# Altium schematic sheet Full_Bridge_Inverter.SchDoc
size A4; SheetNumber: 1; SheetTotal: 3
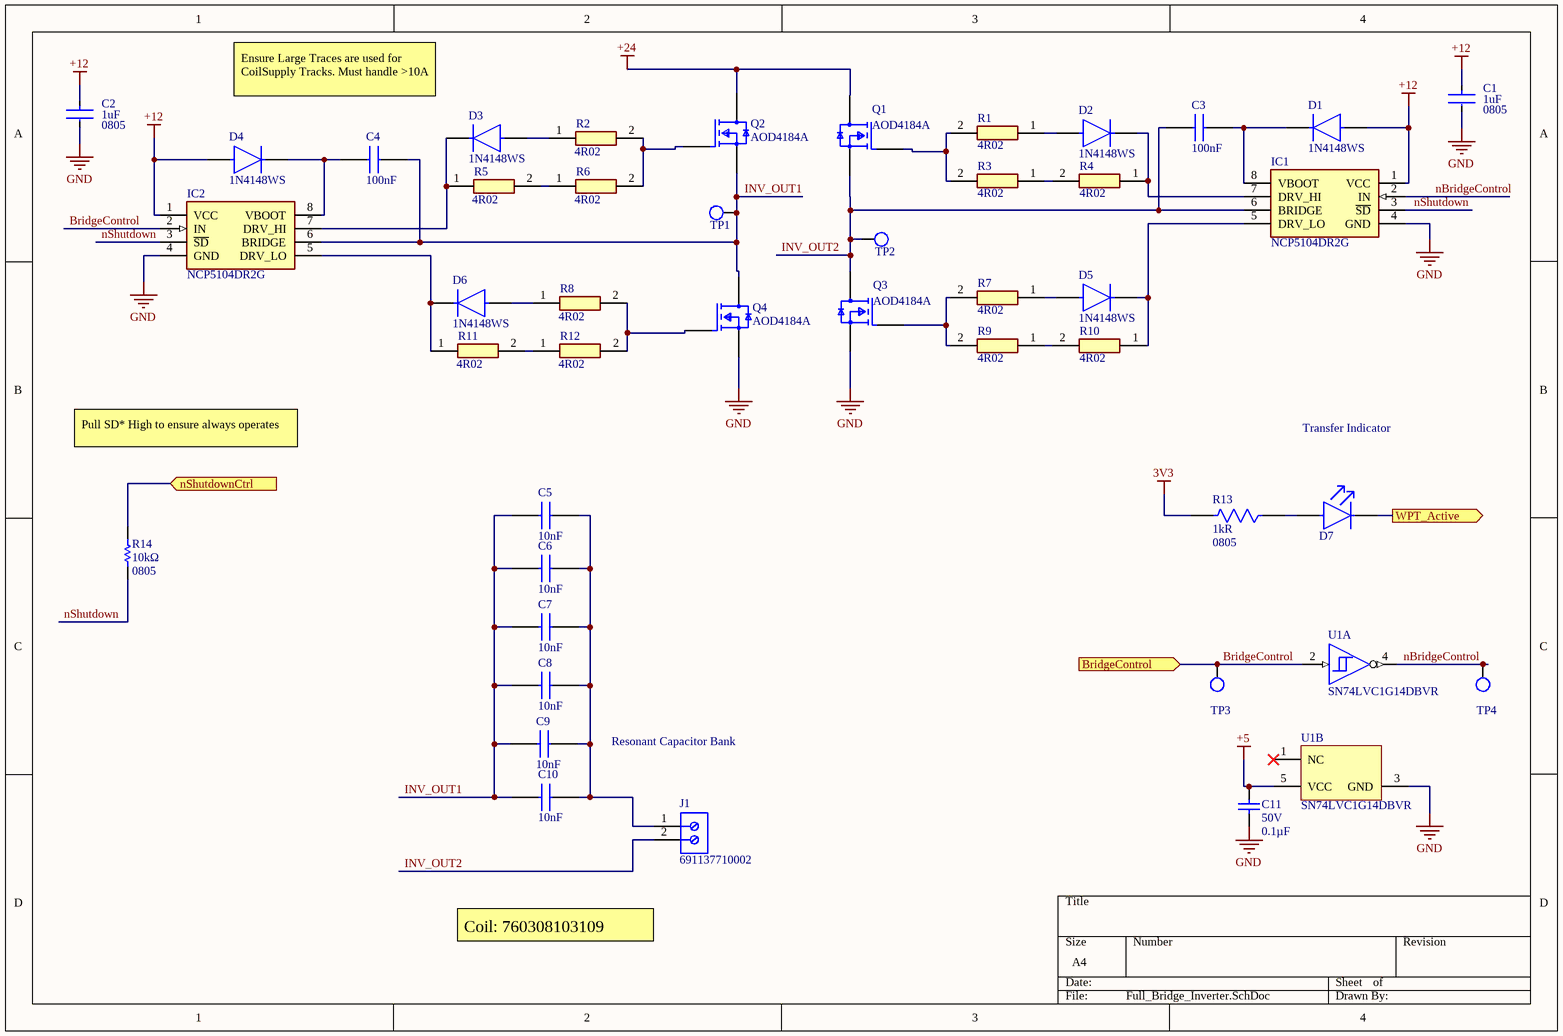
[diagram p0: Full_Bridge_Inverter.SchDoc]

## Parts
C1  Capacitance: 1uF  Case Code (Imperial): 0805  [FP-885012207078-MFG]  (hidden comment: 885012207078)
C2  Capacitance: 1uF  Case Code (Imperial): 0805  [FP-885012207078-MFG]  (hidden comment: 885012207078)
C3  Capacitance: 100nF  [C0805]  (hidden comment: C0805C104K1RACAUTO7210)
C4  Capacitance: 100nF  [C0805]  (hidden comment: C0805C104K1RACAUTO7210)
C5  Capacitance: 10nF  [CAPC3216X110N]  (hidden comment: C1206C103JAGECAUTO)
C6  Capacitance: 10nF  [CAPC3216X110N]  (hidden comment: C1206C103JAGECAUTO)
C7  Capacitance: 10nF  [CAPC3216X110N]  (hidden comment: C1206C103JAGECAUTO)
C8  Capacitance: 10nF  [CAPC3216X110N]  (hidden comment: C1206C103JAGECAUTO)
C9  Capacitance: 10nF  [CAPC3216X110N]  (hidden comment: C1206C103JAGECAUTO)
C10  Capacitance: 10nF  [CAPC3216X110N]  (hidden comment: C1206C103JAGECAUTO)
C11  Voltage - Rated: 50V  Capacitance: 0.1µF  [CAP0805]  (hidden comment: C0805C104K5RACTU)
D1  1N4148WS  [FP-477AB-IPC_C]
D2  1N4148WS  [FP-477AB-IPC_C]
D3  1N4148WS  [FP-477AB-IPC_C]
D4  1N4148WS  [FP-477AB-IPC_C]
D5  1N4148WS  [FP-477AB-IPC_C]
D6  1N4148WS  [FP-477AB-IPC_C]
D7  150060VS75000  [FP-150060VS75000-MFG]  (value not drawn)
IC1  NCP5104DR2G  [SOIC127P600X175-8N]
IC2  NCP5104DR2G  [SOIC127P600X175-8N]
J1  691137710002  [691137710002]
Q1  AOD4184A  [FP-TO252-MFG]
Q2  AOD4184A  [FP-TO252-MFG]
Q3  AOD4184A  [FP-TO252-MFG]
Q4  AOD4184A  [FP-TO252-MFG]
R1  Resistance: 4R02  [RESC3216X70N]  (hidden comment: RMCF1206FT4R02)
R2  Resistance: 4R02  [RESC3216X70N]  (hidden comment: RMCF1206FT4R02)
R3  Resistance: 4R02  [RESC3216X70N]  (hidden comment: RMCF1206FT4R02)
R4  Resistance: 4R02  [RESC3216X70N]  (hidden comment: RMCF1206FT4R02)
R5  Resistance: 4R02  [RESC3216X70N]  (hidden comment: RMCF1206FT4R02)
R6  Resistance: 4R02  [RESC3216X70N]  (hidden comment: RMCF1206FT4R02)
R7  Resistance: 4R02  [RESC3216X70N]  (hidden comment: RMCF1206FT4R02)
R8  Resistance: 4R02  [RESC3216X70N]  (hidden comment: RMCF1206FT4R02)
R9  Resistance: 4R02  [RESC3216X70N]  (hidden comment: RMCF1206FT4R02)
R10  Resistance: 4R02  [RESC3216X70N]  (hidden comment: RMCF1206FT4R02)
R11  Resistance: 4R02  [RESC3216X70N]  (hidden comment: RMCF1206FT4R02)
R12  Resistance: 4R02  [RESC3216X70N]  (hidden comment: RMCF1206FT4R02)
R13  Resistance: 1kR  Size Code: 0805  [FP-RNCP0805-MFG]  (hidden comment: RNCP0805FTD1K00)
R14  Resistance: 10kΩ  Package / Case: 0805  [RES0805]  (hidden comment: RC0805FR-0710KL)
TP1  Bridge 1  [TESTPOINT_LOOP]  (value not drawn)
TP2  Bridge 2  [TESTPOINT_LOOP]  (value not drawn)
TP3  Oscillator Out  [TESTPOINT_LOOP]  (value not drawn)
TP4  NOT Oscillator Out  [TESTPOINT_LOOP]  (value not drawn)
U1  SN74LVC1G14DBVR  [DBV0005A_L]  (parts A,B of 2)

## Ports
BridgeControl (in), nShutdownCtrl (in), WPT_Active (out)

## Nets
3V3: R13.2
+5: C11.2 U1.5(VCC)
+12: C1.1 C2.1 D1.2(A) D4.2(A) IC1.1(VCC) IC2.1(VCC)
+24: Q1.4(D) Q2.4(D)
GND: C1.2 C2.2 C11.1 IC1.4(GND) IC2.4(GND) Q3.3(S) Q4.3(S) U1.3(GND)
BridgeControl: IC2.2(IN) TP3.1 U1.2(A) ; port BridgeControl
INV_OUT1: C4.2 C5.1 C6.1 C7.1 C8.2 C9.2 C10.2 IC2.6(BRIDGE) Q2.3(S) Q4.4(D) TP1.1
INV_OUT2: C3.1 IC1.6(BRIDGE) J1.2 Q1.3(S) Q3.4(D) TP2.1
nBridgeControl: IC1.2(IN) TP4.1 U1.4(Y)
nShutdown: IC1.3(~{SD}) IC2.3(~{SD}) R14.1
nShutdownCtrl: R14.2 ; port nShutdownCtrl
WPT_Active: D7.1(C) ; port WPT_Active
NetC3_2: C3.2 D1.1(C) IC1.8(VBOOT)
NetC4_1: C4.1 D4.1(C) IC2.8(VBOOT)
NetC5_2: C5.2 C6.2 C7.2 C8.1 C9.1 C10.1 J1.1
NetD2_1: D2.1(C) IC1.7(DRV_HI) R4.1
NetD2_2: D2.2(A) R1.1
NetD3_1: D3.1(C) IC2.7(DRV_HI) R5.1
NetD3_2: D3.2(A) R2.1
NetD5_1: D5.1(C) IC1.5(DRV_LO) R10.1
NetD5_2: D5.2(A) R7.1
NetD6_1: D6.1(C) IC2.5(DRV_LO) R11.1
NetD6_2: D6.2(A) R8.1
NetD7_2: D7.2(A) R13.1
NetQ1_1: Q1.1(G) R1.2 R3.2
NetQ2_1: Q2.1(G) R2.2 R6.2
NetQ3_1: Q3.1(G) R7.2 R9.2
NetQ4_1: Q4.1(G) R8.2 R12.2
NetR3_1: R3.1 R4.2
NetR5_2: R5.2 R6.1
NetR9_1: R9.1 R10.2
NetR11_2: R11.2 R12.1

Not connected (* = marked no-connect by the designer): U1 1(NC)*

## Notes on the sheet
- Ensure Large Traces are used for CoilSupply Tracks. Must handle >10A
- Pull SD* High to ensure always operates
- Transfer Indicator
- Resonant Capacitor Bank
- Coil: 760308103109

## Library data of the parts
C1 C2 = CMP-207839-000010-1: CAP CER 1UF 25V X7R 0805; Tolerance: 10%; Series: WCAP-CSGP; Mount: Surface Mount; RoHS Compliant: Yes; Case Code (Metric): 2012; Width: 0.049inch; Thickness: 0.053inch; Dielectric: X7R; Max Operating Temperature: 125°C; Case/Package: 0805; Length: 0.079inch; Voltage Rating: 25V; Packaging: Cut Tape; Min Operating Temperature: -55°C; Voltage Rating (DC): 25V
C3 C4 = C0805C104K1RACAUTO7210: Capacitor; Manufacturer_Name: KEMET; Datasheet Link: https://content.kemet.com/datasheets/KEM_C1023_X7R_AUTO_SMD.pdf; Height: 1.1mm; Manufacturer_Part_Number: C0805C104K1RACAUTO7210; Mouser Part Number: 80-C0805C104K1RAUTLR; Mouser Price/Stock: https://www.mouser.co.uk/ProductDetail/KEMET/C0805C104K1RACAUTO7210?qs=NJR6qtu0rR34GE7CYHVK6Q%3D%3D; Arrow Part Number: C0805C104K1RACAUTO7210; Arrow Price/Stock: https://www.arrow.com/en/products/c0805c104k1racauto7210/kemet-corporation?region=europe
C5-C10 = C1206C103JAGECAUTO: Capacitor; Manufacturer_Name: KEMET; Datasheet Link: https://content.kemet.com/datasheets/KEM_C1091_C0G_ESD.pdf; Height: 1.1mm; Manufacturer_Part_Number: C1206C103JAGECAUTO; Mouser Part Number: 80-C1206C103JAGECAUT; Mouser Price/Stock: https://www.mouser.co.uk/ProductDetail/KEMET/C1206C103JAGECAUTO?qs=MLItCLRbWsxJM3Q8yxQv7A%3D%3D; Arrow Part Number: C1206C103JAGECAUTO; Arrow Price/Stock: https://www.arrow.com/en/products/c1206c103jagecauto/kemet-corporation?region=nac
C11 = C0805C104K5RACTU: CAP CER 0.1UF 50V X7R 0805; Tolerance: ±10%; Supplier 1: Digi-Key; Supplier Part Number 1: 399-1170-1-ND; Temperature Coefficient: X7R; Package / Case: 0805
D1-D6 = CMP-07163-000040-1: DIODE GEN PURP 75V 150MA SOD323F; Forward Voltage: 1V; Power Dissipation: 200mW; Element Configuration: Single; Max Forward Surge Current (Ifsm): 2A; Peak Reverse Current: 5uA; Recovery Time: 4ns; Package Quantity: 1; Number of Pins: 2; Height: 1mm; REACH SVHC: No SVHC; Max Reverse Voltage (DC): 75V; Forward Current: 150mA; Length: 1.8mm; Max Repetitive Reverse Voltage (Vrrm): 75V; Max Operating Temperature: 150°C; Average Rectified Current: 150mA; Contact Plating: Tin; Packaging: Tape and Reel; Radiation Hardening: No; Min Operating Temperature: -55°C; Width: 1.35mm; Weight: 0.0276g; Lead Free: Lead Free; Mount: Surface Mount; Reverse Voltage: 75V; Reverse Recovery Time: 4ns
D7 = CMP-1426-00006-5: LED GREEN CLEAR 0603 SMD; Viewing Angle: 140°; Reverse Voltage (DC): 5V; Forward Voltage: 2V; Power Rating: 72mW; Lens Size: 0.7mm; Test Current: 20mA; Lens Color: Colorless; Lens Style: Rectangular; Luminous Intensity: 40mcd; Wavelength: 570nm; Length: 1.6mm; Max Operating Temperature: 85°C; Lens Transparency: Clear; Width: 0.8mm; Mount: Surface Mount; Weight: 0.000882oz; Package Quantity: 4000; Packaging: Cut Tape; RoHS Compliant: Yes; Case/Package: 0603; Series: WL-SMCW; Case Code (Metric): 1608; Illumination Color: Green; Color: Green; Case Code (Imperial): 0603; Forward Current: 20mA; Min Operating Temperature: -40°C; Height: 0.8mm; Dominant Wavelength: 570nm; Number of Pins: 2
IC1 IC2 = NCP5104DR2G: Integrated Circuit; Manufacturer_Name: onsemi; Datasheet Link: http://www.onsemi.com/pub/Collateral/NCP5104-D.PDF; Height: 1.75mm; Manufacturer_Part_Number: NCP5104DR2G; Mouser Part Number: 863-NCP5104DR2G; Mouser Price/Stock: https://www.mouser.co.uk/ProductDetail/onsemi/NCP5104DR2G?qs=t2BMfLoP1KTbDonJSvc7wQ%3D%3D; Arrow Part Number: NCP5104DR2G; Arrow Price/Stock: https://www.arrow.com/en/products/ncp5104dr2g/on-semiconductor
J1 = CMP-1502-03324-1: Series 1377 - 5.00 mm Horizontal Entry with Pressure Clamp WR-TBL, 2 pin; Manufacturer: Wurth Elektronik; Pin Number: 2; Pitch: 5.00mm; Operating Temperature: -30to120degC; Package Reference: 691137710002; Publisher: WurthElektronik; Mounting Technology: THT; Manufacturer URL: http://www.we-online.de; Packaging: Box; Part Number: 691137710002; Datasheet URL: http://katalog.we-online.de/pbs/datasheet/691137710002.pdf
Q1-Q4 = CMP-83955-000007-1: MOSFET N-CH 40V 50A TO252; Power Dissipation: 50W; Rds On Max: 7mR; Input Capacitance: 1.8nF; Gate to Source Voltage (Vgs): 20V; Number of Elements: 1; Max Power Dissipation: 2.3W; Min Operating Temperature: -55°C; Drain to Source Voltage (Vdss): 40V; Max Operating Temperature: 175°C; Case/Package: DPAK; Mount: Surface Mount; Continuous Drain Current (ID): 50A; Packaging: Cut Tape; Number of Pins: 3; Radiation Hardening: No
R1-R12 = RMCF1206FT4R02: Resistor; Manufacturer_Name: Stackpole Electronics; Datasheet Link: https://cs.seielect.com/catalog/SEI-RMCF_RMCP.pdf; Height: 0.7mm; Manufacturer_Part_Number: RMCF1206FT4R02; Arrow Part Number: RMCF1206FT4R02; Arrow Price/Stock: https://www.arrow.com/en/products/rmcf1206ft4r02/stackpole-electronics
R13 = CMP-26527-001902-1: 1kΩ ±1% 0.25W 0805 High Power Anti-Sulfur Thin Film Chip Resistor; Power Rating: 250mW; Temperature Coefficient: 100ppm/°C; Series: RNCP; RoHS Compliant: Yes; Case Code (Metric): 2012; Length: 0.079inch; Case/Package: 0805; Max Power Dissipation: 250mW; Height: 0.024inch; Max Operating Temperature: 155°C; Tolerance: 1%; Min Operating Temperature: -55°C; Width: 0.049inch; Case Code (Imperial): 0805; Packaging: Tape and Reel; Mount: Surface Mount; Features: Moisture Resistant; Lead Free: Lead Free; Resistor Type: Thin Film; Number of Terminations: 2
R14 = RC0805FR-0710KL: RES SMD 10K OHM 1% 1/8W 0805; Manufacturer: Yageo; Power (Watts): 0.125W, 1/8W; Temperature Coefficient: ±100ppm/°C; Supplier 1: Digi-Key; Supplier Part Number 1: 311-10.0KCRCT-ND; Tolerance: ±1%; Composition: Thick Film; Features: Moisture Resistant; Operating Temperature: -55°C ~ 155°C
TP1-TP4 = TESTPOINT_LOOP: PC TEST POINT MINIATURE WHITE; Manufacturer 1: Keystone Electronics; Manufacturer Part Number 1: 5002; Supplier Part Number 1: 36-5002-ND; Supplier 1: Digi-Key; Mount: Through Hole
U1 = CMP-0859-00030-4: Single Schmitt-Trigger Inverter, DBV0005A, LARGE T&R; Manufacturer: Texas Instruments; Input Type: CMOS/TTL; Output Drive (IOL/IOH)(Max)(mA): 32/-32; VCC(Min)(V): 1.65; 3-State Output: No; Schmitt Trigger: Yes; tpd @ Nom Voltage(Max)(ns): 11,6.5,5.5,5; VCC(Max)(V): 5.5; Output Type: CMOS; Bits(#): 1; Voltage(Nom)(V): 1.8,2.5,3.3,5; Sub-Family: Inverting Buffer/Driver; Logic: Inverting; Technology Family: LVC; F @ Nom Voltage(Max)(Mhz): 150; Rating: Catalog; ICC @ Nom Voltage(Max)(mA): 0.01; DatasheetVersion: SCES218W; PackageReference: DBV0005A; Generic Part Number: SN74LVC1G14; Operating Temperature Range(C): -40 to 125,-40 to 85